# Altium schematic sheet Heart-Earrings_2025-02-13.schdoc
size 1484 x 217 mm
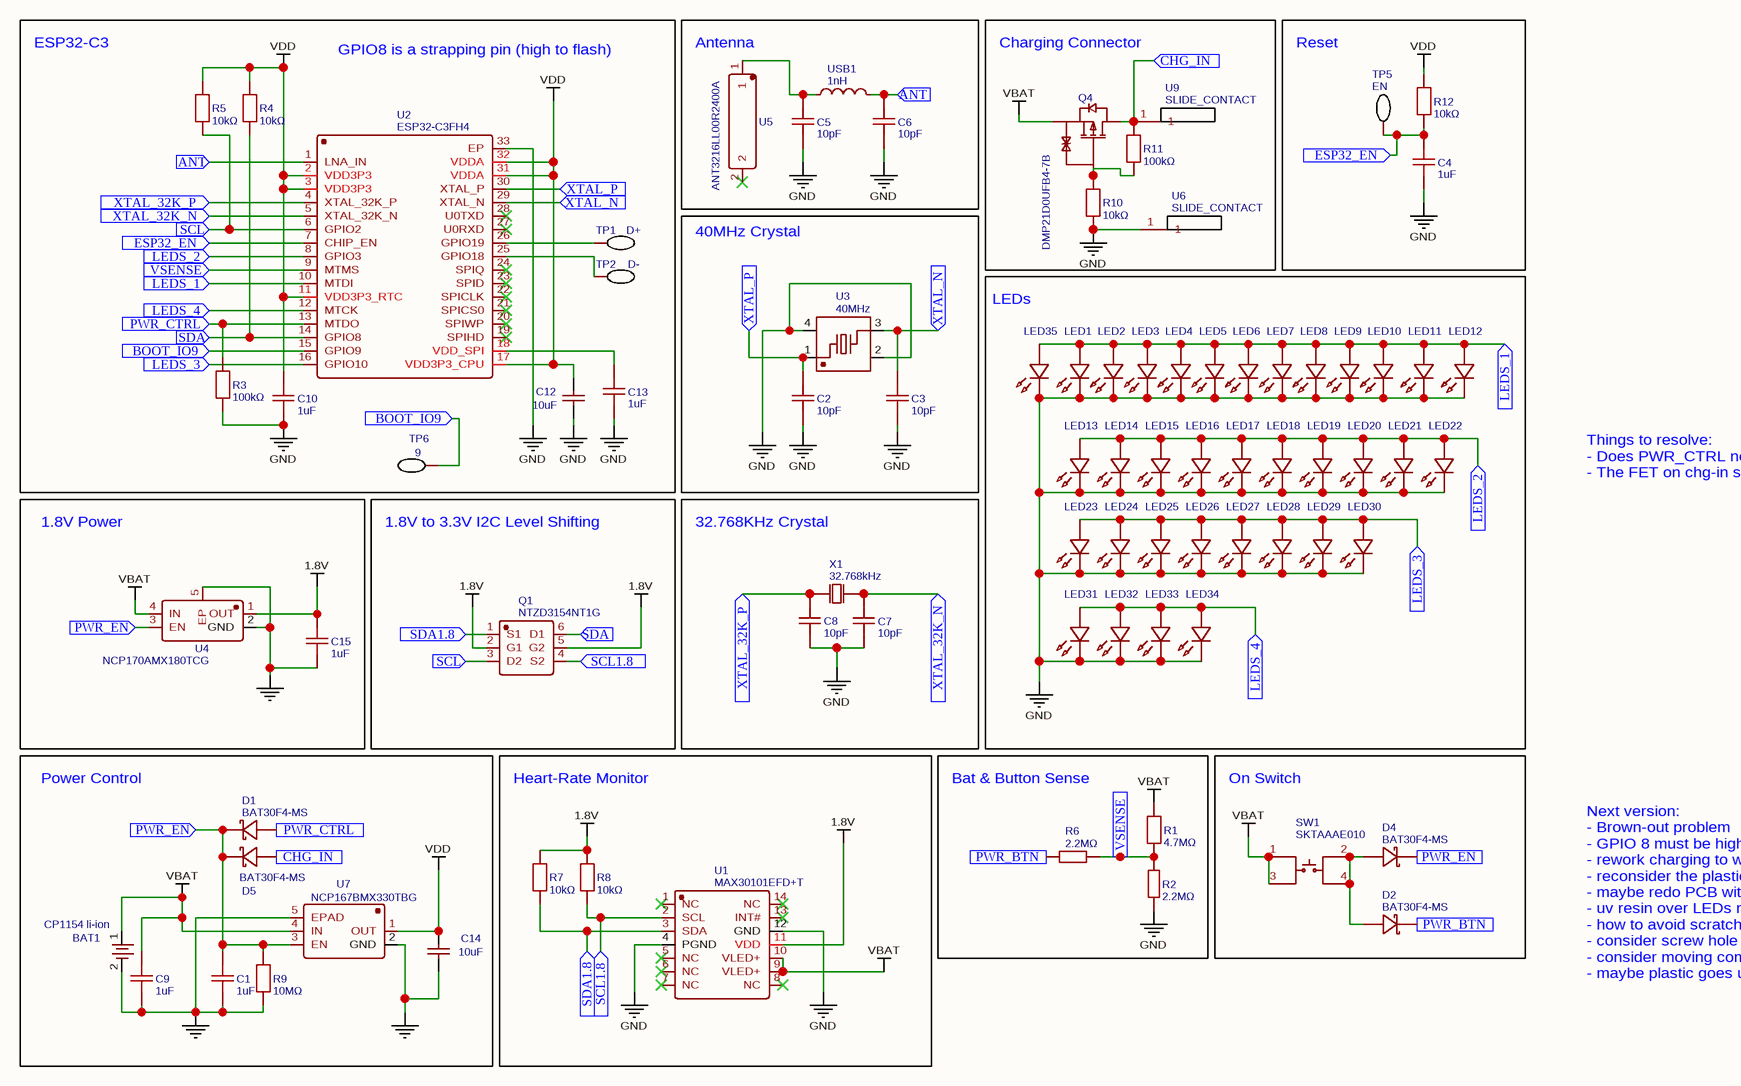
[diagram p0: Heart-Earrings_2025-02-13.schdoc]

## Parts
BAT1  CP1154 li-ion  [CP1154_LI_ION_NO_SILK]
C1  1uF  [C0201]
C2  10pF  [C0201]
C3  10pF  [C0201]
C4  1uF  [C0201]
C5  10pF  [C0201]
C6  10pF  [C0201]
C7  10pF  [C0201]
C8  10pF  [C0201]
C9  1uF  [C0201]
C10  1uF  [C0201]
C12  10uF  [C0402]
C13  1uF  [C0201]
C14  10uF  [C0402]
C15  1uF  [C0201]
D1  BAT30F4-MS  [X3-DFN0603-2_L0.6-W0.3-RD]
D2  BAT30F4-MS  [X3-DFN0603-2_L0.6-W0.3-RD]
D4  BAT30F4-MS  [X3-DFN0603-2_L0.6-W0.3-RD]
D5  BAT30F4-MS  [X3-DFN0603-2_L0.6-W0.3-RD]
LED1  XL-0201SURC  [LED-SMD_L0.7-W0.4-RD]  (value not drawn)
LED2  XL-0201SURC  [LED-SMD_L0.7-W0.4-RD]  (value not drawn)
LED3  XL-0201SURC  [LED-SMD_L0.7-W0.4-RD]  (value not drawn)
LED4  XL-0201SURC  [LED-SMD_L0.7-W0.4-RD]  (value not drawn)
LED5  XL-0201SURC  [LED-SMD_L0.7-W0.4-RD]  (value not drawn)
LED6  XL-0201SURC  [LED-SMD_L0.7-W0.4-RD]  (value not drawn)
LED7  XL-0201SURC  [LED-SMD_L0.7-W0.4-RD]  (value not drawn)
LED8  XL-0201SURC  [LED-SMD_L0.7-W0.4-RD]  (value not drawn)
LED9  XL-0201SURC  [LED-SMD_L0.7-W0.4-RD]  (value not drawn)
LED10  XL-0201SURC  [LED-SMD_L0.7-W0.4-RD]  (value not drawn)
LED11  XL-0201SURC  [LED-SMD_L0.7-W0.4-RD]  (value not drawn)
LED12  XL-0201SURC  [LED-SMD_L0.7-W0.4-RD]  (value not drawn)
LED13  XL-0201SURC  [LED-SMD_L0.7-W0.4-RD]  (value not drawn)
LED14  XL-0201SURC  [LED-SMD_L0.7-W0.4-RD]  (value not drawn)
LED15  XL-0201SURC  [LED-SMD_L0.7-W0.4-RD]  (value not drawn)
LED16  XL-0201SURC  [LED-SMD_L0.7-W0.4-RD]  (value not drawn)
LED17  XL-0201SURC  [LED-SMD_L0.7-W0.4-RD]  (value not drawn)
LED18  XL-0201SURC  [LED-SMD_L0.7-W0.4-RD]  (value not drawn)
LED19  XL-0201SURC  [LED-SMD_L0.7-W0.4-RD]  (value not drawn)
LED20  XL-0201SURC  [LED-SMD_L0.7-W0.4-RD]  (value not drawn)
LED21  XL-0201SURC  [LED-SMD_L0.7-W0.4-RD]  (value not drawn)
LED22  XL-0201SURC  [LED-SMD_L0.7-W0.4-RD]  (value not drawn)
LED23  XL-0201SURC  [LED-SMD_L0.7-W0.4-RD]  (value not drawn)
LED24  XL-0201SURC  [LED-SMD_L0.7-W0.4-RD]  (value not drawn)
LED25  XL-0201SURC  [LED-SMD_L0.7-W0.4-RD]  (value not drawn)
LED26  XL-0201SURC  [LED-SMD_L0.7-W0.4-RD]  (value not drawn)
LED27  XL-0201SURC  [LED-SMD_L0.7-W0.4-RD]  (value not drawn)
LED28  XL-0201SURC  [LED-SMD_L0.7-W0.4-RD]  (value not drawn)
LED29  XL-0201SURC  [LED-SMD_L0.7-W0.4-RD]  (value not drawn)
LED30  XL-0201SURC  [LED-SMD_L0.7-W0.4-RD]  (value not drawn)
LED31  XL-0201SURC  [LED-SMD_L0.7-W0.4-RD]  (value not drawn)
LED32  XL-0201SURC  [LED-SMD_L0.7-W0.4-RD]  (value not drawn)
LED33  XL-0201SURC  [LED-SMD_L0.7-W0.4-RD]  (value not drawn)
LED34  XL-0201SURC  [LED-SMD_L0.7-W0.4-RD]  (value not drawn)
LED35  XL-0201SURC  [LED-SMD_L0.7-W0.4-RD]  (value not drawn)
Q1  NTZD3154NT1G  [SOT-563_L1.6-W1.2-P0.50-LS1.6-TL]
Q4  DMP21D0UFB4-7B  [X2-DFN1006-3_L1.0-W0.6-BR]
R1  4.7MΩ  [R0201]
R2  2.2MΩ  [R0201]
R3  100kΩ  [R0201]
R4  10kΩ  [R0201]
R5  10kΩ  [R0201]
R6  2.2MΩ  [R0201]
R7  10kΩ  [R0201]
R8  10kΩ  [R0201]
R9  10MΩ  [R0201]
R10  10kΩ  [R0201]
R11  100kΩ  [R0201]
R12  10kΩ  [R0201]
SW1  SKTAAAE010  [KEY-SMD_4P-L2.6-W1.6-P0.80-LS3.0]
TP1  D+  [TESTPAD0]
TP2  D-  [TESTPAD0]
TP5  EN  [TESTPAD0]
TP6  9  [TESTPAD0]
U1  MAX30101EFD+T  [OESIP-14_L5.6-W3.3-P0.80-TL]
U2  ESP32-C3FH4  [QFN-32_L5.0-W5.0-P0.50-TL-EP3.7]
U3  40MHz  [CRYSTAL-SMD_4P-L1.6-W1.2-BL]
U4  NCP170AMX180TCG  [XDFN-4_L1.0-W1.0-P0.65-BL-EP]
U5  ANT3216LL00R2400A  [ANT-SMD_L3.2-W1.6]
U6  SLIDE_CONTACT  [SLIDE_CONTACT]
U7  NCP167BMX330TBG  [XDFN-4_L1.0-W1.0-P0.65-BL-EP]
U9  SLIDE_CONTACT  [SLIDE_CONTACT]
USB1  1nH  [L0201]
X1  32.768kHz  [CRYSTAL-SMD_L1.7-W1.1]

## Blocks framed on the sheet
Antenna: C5 C6 U5 USB1
Charging Connector: Q4 R10 R11 U6 U9
Reset: C4 R12 TP5
40MHz Crystal: C2 C3 U3
LEDs: LED1-LED35
1.8V Power: C15 U4
1.8V to 3.3V I2C Level Shifting: Q1
32.768KHz Crystal: C7 C8 X1
Power Control: BAT1 C1 C9 C14 D1 D5 R9 U7
Heart-Rate Monitor: R7 R8 U1
Bat & Button Sense: R1 R2 R6
On Switch: D2 D4 SW1

## Ports
ANT (in), BOOT_IO9 (in), CHG_IN (in), ESP32_EN (in), LEDS_1 (in), LEDS_2 (in), LEDS_3 (in), LEDS_4 (in), PWR_BTN (in), PWR_CTRL (in), PWR_EN (in), SCL1.8 (in), SCL (in), SDA1.8 (in), SDA (in), VSENSE (in), XTAL_32K_N (in), XTAL_32K_P (in), XTAL_N (in), XTAL_P (in)

## Nets
1.8V: C15.2 Q1.2(G1) Q1.5(G2) R7.2 R8.2 U1.11(VDD) U4.1(OUT)
GND: BAT1.2(BAT-) C1.1 C2.1 C3.1 C4.1 C5.1 C6.1 C7.1 C8.2 C9.1 C10.1 C12.1 C13.1 C14.1 C15.1 LED1.1(K) LED2.1(K) LED3.1(K) LED4.1(K) LED5.1(K) LED6.1(K) LED7.1(K) LED8.1(K) LED9.1(K) LED10.1(K) LED11.1(K) LED12.1(K) LED13.1(K) LED14.1(K) LED15.1(K) LED16.1(K) LED17.1(K) LED18.1(K) LED19.1(K) LED20.1(K) LED21.1(K) LED22.1(K) LED23.1(K) LED24.1(K) LED25.1(K) LED26.1(K) LED27.1(K) LED28.1(K) LED29.1(K) LED30.1(K) LED31.1(K) LED32.1(K) LED33.1(K) LED34.1(K) LED35.1(K) R2.1 R3.1 R9.1 R10.1 U1.4(PGND) U1.12(GND) U2.33(EP) U3.2(GND) U3.4(GND) U4.2(GND) U4.5(EP) U6.1 U7.2(GND) U7.5(EPAD)
VBAT: BAT1.1(BAT+) C9.2 Q4.2(S) R1.2 SW1.1 SW1.3 U1.9(VLED+) U1.10(VLED+) U4.4(IN) U7.4(IN)
VDD: C10.2 C12.2 C14.2 R4.2 R5.2 R12.2 U2.2(VDD3P3) U2.3(VDD3P3) U2.11(VDD3P3_RTC) U2.17(VDD3P3_CPU) U2.31(VDDA) U2.32(VDDA) U7.1(OUT)
ANT: C6.2 U2.1(LNA_IN) USB1.2 ; port ANT
BOOT_IO9: TP6.1 U2.15(GPIO9) ; port BOOT_IO9
CHG_IN: D5.2(A) Q4.3(D) R11.2 U9.1 ; port CHG_IN
ESP32_EN: C4.2 R12.1 TP5.1 U2.7(CHIP_EN) ; port ESP32_EN
LEDS_1: LED1.2(A) LED2.2(A) LED3.2(A) LED4.2(A) LED5.2(A) LED6.2(A) LED7.2(A) LED8.2(A) LED9.2(A) LED10.2(A) LED11.2(A) LED12.2(A) LED35.2(A) U2.10(MTDI) ; port LEDS_1
LEDS_2: LED13.2(A) LED14.2(A) LED15.2(A) LED16.2(A) LED17.2(A) LED18.2(A) LED19.2(A) LED20.2(A) LED21.2(A) LED22.2(A) U2.8(GPIO3) ; port LEDS_2
LEDS_3: LED23.2(A) LED24.2(A) LED25.2(A) LED26.2(A) LED27.2(A) LED28.2(A) LED29.2(A) LED30.2(A) U2.16(GPIO10) ; port LEDS_3
LEDS_4: LED31.2(A) LED32.2(A) LED33.2(A) LED34.2(A) U2.12(MTCK) ; port LEDS_4
PWR_BTN: D2.1(K) R6.2 ; port PWR_BTN
PWR_CTRL: D1.2(A) R3.2 U2.13(MTDO) ; port PWR_CTRL
PWR_EN: C1.2 D1.1(K) D4.1(K) D5.1(K) R9.2 U4.3(EN) U7.3(EN) ; port PWR_EN
SCL: Q1.3(D2) R5.1 U2.6(GPIO2) ; port SCL
SCL1.8: Q1.4(S2) R8.1 U1.2(SCL) ; port SCL1.8
SDA: Q1.6(D1) R4.1 U2.14(GPIO8) ; port SDA
SDA1.8: Q1.1(S1) R7.1 U1.3(SDA) ; port SDA1.8
VSENSE: R1.1 R2.2 R6.1 U2.9(MTMS) ; port VSENSE
XTAL_32K_N: C7.2 U2.5(XTAL_32K_N) X1.1(OSC1) ; port XTAL_32K_N
XTAL_32K_P: C8.1 U2.4(XTAL_32K_P) X1.2(OSC2) ; port XTAL_32K_P
XTAL_N: C3.2 U2.29(XTAL_N) U3.3 ; port XTAL_N
XTAL_P: C2.2 U2.30(XTAL_P) U3.1 ; port XTAL_P
NetC5_2: C5.2 U5.1 USB1.1
NetC13_2: C13.2 U2.18(VDD_SPI)
NetD2_2: D2.2(A) D4.2(A) SW1.2 SW1.4
NetQ4_1: Q4.1(G) R10.2 R11.1
NetTP1_1: TP1.1 U2.26(GPIO19)
NetTP2_1: TP2.1 U2.25(GPIO18)

Not connected (* = marked no-connect by the designer): U1 1(NC)* 5(NC)* 6(NC)* 7(NC)* 8(NC)* 13(INT#)* 14(NC)*; U2 19(SPIHD)* 20(SPIWP)* 21(SPICS0)* 22(SPICLK)* 23(SPID)* 24(SPIQ)* 27(U0RXD)* 28(U0TXD)*; U5 2*

## Notes on the sheet
- ESP32-C3
- GPIO8 is a strapping pin (high to flash)
- Things to resolve:
  - Does PWR_CTRL need a pull down - if so why and what value? 10K seems low
  - The FET on chg-in seems to affect charging - maybe replace with diode?
- Next version:
  - Brown-out problem
  - GPIO 8 must be high on boot
  - rework charging to work with digikey 108388050 - flatten bottom of heart - move contacts towards centre (or at least flat part) - move switch?
  - reconsider the plastics to press switch, protect battery terminals and guide into charger at the same time as above
  - maybe redo PCB with no assembly to ensure mechanical parts and charging work
  - uv resin over LEDs might make tolerances tricky for charging?
  - how to avoid scratching resin when placing in charger - test out strength of resin over continual insertions into charger
  - consider screw hole locations
  - consider moving components away from switches to make plastics easier
  - maybe plastic goes underneath battery

## Library data of the parts
BAT1 = CP1154 li-ion: Manufacturer: Varta; Manufacturer Part: MY-2032-10; Contributor: robdobsn; Supplier Part: CP1154 A3HOC; JLCPCB Part Class: Extended Part; spicePre: B; spiceSymbolName: CP1154 li-ion
C1 C4 C9 C10 C13 C15 = 1uF: Manufacturer: SAMSUNG(三星); Manufacturer Part: CL03A105MP3NSNH; nameAlias: Value; Contributor: lcsc; Supplier: LCSC; Supplier Part: C2991185; JLCPCB Part Class: Extended Part; link: https://lcsc.com/eda_search?q=C2991185&%26type=1&ref=editor; spicePre: C; spiceSymbolName: CL03A105MP3NSNH
C2 C3 C5-C8 = 10pF: Manufacturer: muRata(村田); Manufacturer Part: GRM0335C1H100FA01D; nameAlias: Value; Contributor: LCSC; Supplier: LCSC; Supplier Part: C384956; JLCPCB Part Class: Extended Part; spicePre: C; spiceSymbolName: GRM0335C1H100FA01D
C12 C14 = 10uF: Manufacturer Part: CL05A106MQ5NUNC; Manufacturer: SAMSUNG(三星); nameAlias: Value; Supplier: LCSC; Supplier Part: C15525; JLCPCB Part Class: Basic Part; spicePre: C; spiceSymbolName: CL05A106MQ5NUNC
D1 D2 D4 D5 = BAT30F4-MS: Manufacturer: MSKSEMI(美森科); Contributor: lcsc; Supplier: LCSC; Supplier Part: C2914452; Manufacturer Part: BAT30F4-MS; JLCPCB Part Class: Extended Part; spicePre: D; spiceSymbolName: BAT30F4-MS
LED1-LED35 = XL-0201SURC: Manufacturer: XINGLIGHT(成兴光); Contributor: lcsc; Supplier: LCSC; Supplier Part: C3646923; Manufacturer Part: XL-0201SURC; JLCPCB Part Class: Extended Part; spicePre: L; spiceSymbolName: XL-0201UWC; link: https://www.lcsc.com/product-detail/Light-Emitting-Diodes-LED_XINGLIGHT-XL-0201SURC_C3646923.html
Q1 = NTZD3154NT1G: Manufacturer: onsemi(安森美); Contributor: LCSC; Supplier: LCSC; Manufacturer Part: NTZD3154NT1G; Supplier Part: C145189; JLCPCB Part Class: Extended Part; link: https://lcsc.com/eda_search?q=C145189&%26type=1&ref=editor; spicePre: Q; spiceSymbolName: NTZD3154NT1G
Q4 = DMP21D0UFB4-7B: Manufacturer: DIODES(美台); Contributor: LCSC; Supplier: LCSC; Supplier Part: C155329; Manufacturer Part: DMP21D0UFB4-7B; JLCPCB Part Class: Extended Part; spicePre: Q; spiceSymbolName: DMP21D0UFB4-7B
R1 = 4.7MΩ: Manufacturer: UNI-ROYAL(厚声); Manufacturer Part: 0201WMF4704TEE; Contributor: LCSC; nameAlias: Value; Supplier: LCSC; Supplier Part: C778408; JLCPCB Part Class: Extended Part; link: https://lcsc.com/eda_search?q=C778408&%26type=1&ref=editor; spicePre: R; spiceSymbolName: 0201WMF4704TEE
R2 R6 = 2.2MΩ: Manufacturer: YAGEO(国巨); Manufacturer Part: RC0201FR-072M2L; Contributor: lcsc; nameAlias: Value; Supplier: LCSC; Supplier Part: C474576; JLCPCB Part Class: Extended Part; spicePre: R; spiceSymbolName: RC0201FR-072M2L
R3 R11 = 100kΩ: Manufacturer: VISHAY(威世); Manufacturer Part: CRCW0201100KFKED; Contributor: lcsc; nameAlias: Value; Supplier: LCSC; Supplier Part: C843835; JLCPCB Part Class: Extended Part; spicePre: U; spiceSymbolName: CRCW0201100KFKED
R4 R5 R7 R8 R10 R12 = 10kΩ: Manufacturer: VISHAY(威世); Manufacturer Part: CRCW020110K0FKED; Contributor: LCSC; nameAlias: Value; Supplier: LCSC; Supplier Part: C844303; JLCPCB Part Class: Extended Part; spicePre: R; spiceSymbolName: CRCW020110K0FKED
R9 = 10MΩ: Manufacturer: UNI-ROYAL(厚声); Manufacturer Part: 0201WMF1005TEE; nameAlias: Value; Contributor: lcsc; Supplier: LCSC; Supplier Part: C423797; JLCPCB Part Class: Extended Part; link: https://lcsc.com/eda_search?q=C423797&%26type=1&ref=editor; spicePre: R; spiceSymbolName: 0201WMF1005TEE
SW1 = SKTAAAE010: Manufacturer: ALPSALPINE(阿尔卑斯阿尔派); Contributor: LCSC; Supplier: LCSC; Supplier Part: C358616; Manufacturer Part: SKTAAAE010; JLCPCB Part Class: Extended Part; spicePre: S; spiceSymbolName: SKTAAAE010
TP1 = D+: Manufacturer Part: TESTPAD; Contributor: wenjuntijee; spicePre: T; spiceSymbolName: TEST_PAD
TP2 = D-: Manufacturer Part: TESTPAD; Contributor: wenjuntijee; spicePre: T; spiceSymbolName: TEST_PAD
TP5 = EN: Manufacturer Part: TESTPAD; Contributor: wenjuntijee; spicePre: T; spiceSymbolName: TEST_PAD
TP6 = 9: Manufacturer Part: TESTPAD; Contributor: wenjuntijee; spicePre: T; spiceSymbolName: TEST_PAD
U1 = MAX30101EFD+T: Manufacturer: MAXIM(美信); Contributor: LCSC; Supplier: LCSC; Supplier Part: C2859066; Manufacturer Part: MAX30101EFD+T; JLCPCB Part Class: Extended Part; link: https://lcsc.com/eda_search?q=C2859066&%26type=1&ref=editor; spicePre: U; spiceSymbolName: MAX30101EFD+T
U2 = ESP32-C3FH4: Manufacturer: ESPRESSIF(乐鑫); Contributor: LCSC; Supplier: LCSC; Supplier Part: C2858491; Manufacturer Part: ESP32-C3FH4; JLCPCB Part Class: Extended Part; spicePre: U; spiceSymbolName: ESP32-C3FH4
U3 = 40MHz: Manufacturer: JYJE(晶友嘉); Manufacturer Part: TJ1140000HYGBC; nameAlias: Value; Contributor: lcsc; Supplier: LCSC; Supplier Part: C2826919; JLCPCB Part Class: Extended Part; spicePre: U; spiceSymbolName: TJ1140000HYGBC
U4 = NCP170AMX180TCG: Manufacturer: onsemi(安森美); Contributor: LCSC; Supplier: LCSC; Supplier Part: C603665; Manufacturer Part: NCP170AMX180TCG; JLCPCB Part Class: Extended Part; spicePre: U; spiceSymbolName: NCP170AMX180TCG
U5 = ANT3216LL00R2400A: Manufacturer: YAGEO(国巨); Contributor: LCSC; Supplier: LCSC; Supplier Part: C293767; Manufacturer Part: ANT3216LL00R2400A; JLCPCB Part Class: Extended Part; link: https://lcsc.com/eda_search?q=C293767&%26type=1&ref=editor; spicePre: U; spiceSymbolName: ANT3216LL00R2400A
U6 U9 = SLIDE_CONTACT: Contributor: robdobsn; spicePre: U; spiceSymbolName: SLIDE_CONTACT
U7 = NCP167BMX330TBG: Manufacturer: onsemi(安森美); Contributor: LCSC; Supplier: LCSC; Supplier Part: C892227; Manufacturer Part: NCP167BMX330TBG; JLCPCB Part Class: Extended Part; link: https://lcsc.com/eda_search?q=C892227&%26type=1&ref=editor; spicePre: U; spiceSymbolName: NCP167BMX330TBG
USB1 = 1nH: Manufacturer: TDK; Manufacturer Part: MLG0603P1N0BTD25; Contributor: LCSC; nameAlias: Value; Supplier: LCSC; Supplier Part: C404536; spicePre: U; spiceSymbolName: MLG0603P1N0BTD25
X1 = 32.768kHz: Manufacturer: EPSON(爱普生); Manufacturer Part: X1A000121000500; Contributor: lcsc; nameAlias: Value; Supplier: LCSC; Supplier Part: C5154201; JLCPCB Part Class: Extended Part; spicePre: X; spiceSymbolName: X1A000121000500